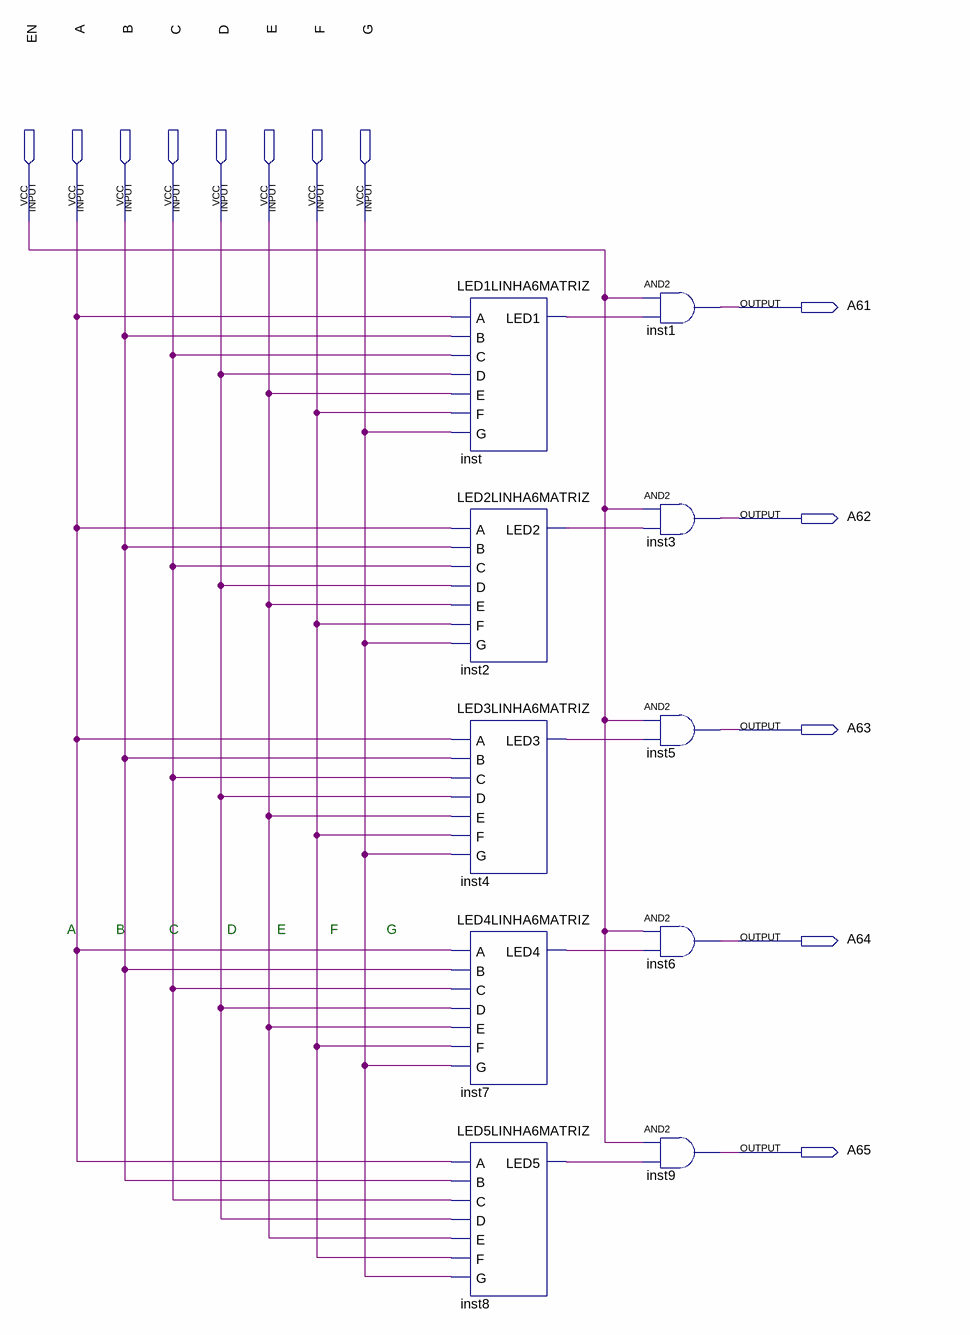
[diagram p0: schematic sheet]
// Quartus schematic Linha6.bdf as structural Verilog: 10 symbols, 13 pins
module Linha6 (
  input  EN,
  input  A,
  input  B,
  input  C,
  input  D,
  input  E,
  input  F,
  input  G,
  output A61,
  output A62,
  output A63,
  output A64,
  output A65
);

  wire inst2_led2, inst4_led3, inst7_led4, inst8_led5, inst_led1;

  LED1LINHA6MATRIZ inst (.A(A), .B(B), .C(C), .D(D), .E(E), .F(F), .G(G), .LED1(inst_led1));
  LED2LINHA6MATRIZ inst2 (.A(A), .B(B), .C(C), .D(D), .E(E), .F(F), .G(G), .LED2(inst2_led2));
  LED3LINHA6MATRIZ inst4 (.A(A), .B(B), .C(C), .D(D), .E(E), .F(F), .G(G), .LED3(inst4_led3));
  LED4LINHA6MATRIZ inst7 (.A(A), .B(B), .C(C), .D(D), .E(E), .F(F), .G(G), .LED4(inst7_led4));
  LED5LINHA6MATRIZ inst8 (.A(A), .B(B), .C(C), .D(D), .E(E), .F(F), .G(G), .LED5(inst8_led5));
  and inst1 (A61, EN, inst_led1);
  and inst3 (A62, EN, inst2_led2);
  and inst5 (A63, EN, inst4_led3);
  and inst6 (A64, EN, inst7_led4);
  and inst9 (A65, EN, inst8_led5);

  // Notes on the sheet:
  //   A          B           C            D          E           F            G
endmodule
